# EAGLE schematic badge_mil (EAGLE 7.1.0)
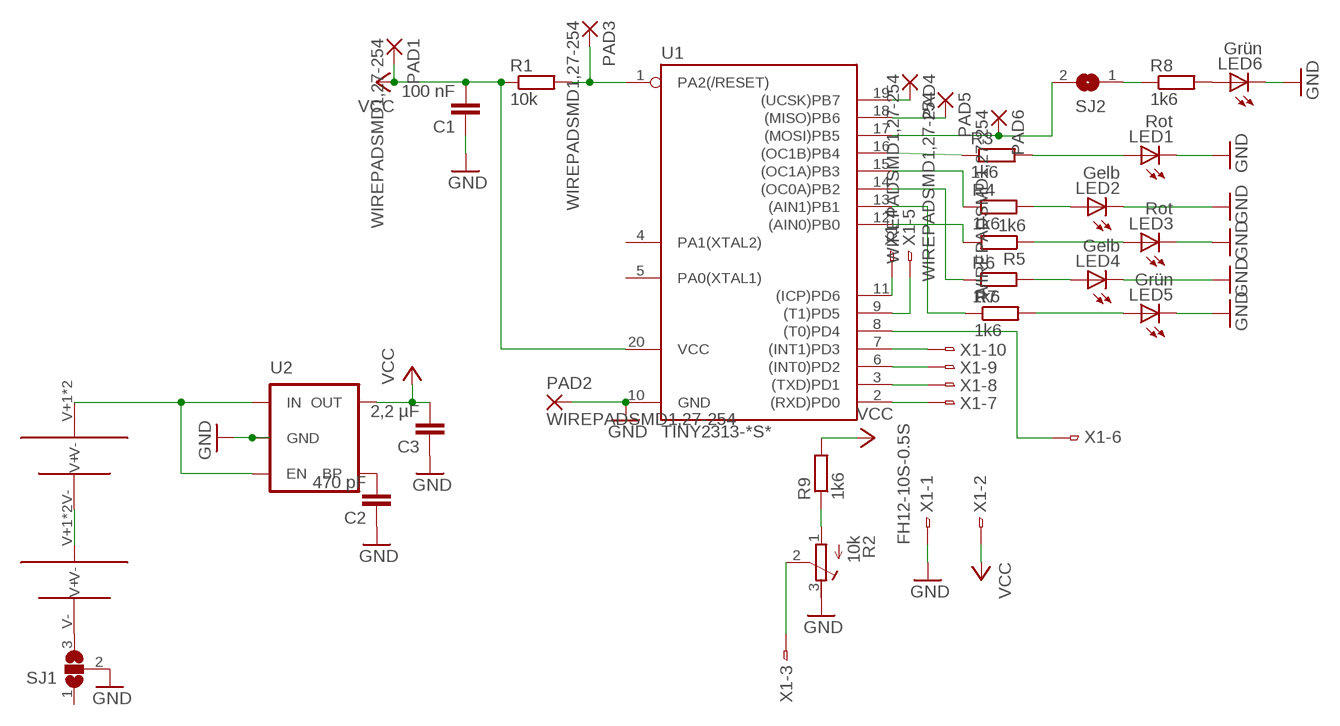
[diagram p0: schematic, sheet 1]

## Parts
C1  100 nF  C-EUC0805  [C0805]
C2  470 pF  C-EUC0805  [C0805]
C3  2,2 µF  C-EUC0805  [C0805]
LED1  Rot  LEDSML0603  [SML0603]
LED2  Gelb  LEDSML0603  [SML0603]
LED3  Rot  LEDSML0603  [SML0603]
LED4  Gelb  LEDSML0603  [SML0603]
LED5  Grün  LEDSML0603  [SML0603]
LED6  Grün  LEDSML0603  [SML0603]
PAD1  WIREPADSMD1,27-254  [SMD1,27-2,54]
PAD2  WIREPADSMD1,27-254  [SMD1,27-2,54]
PAD3  WIREPADSMD1,27-254  [SMD1,27-2,54]
PAD4  WIREPADSMD1,27-254  [SMD1,27-2,54]
PAD5  WIREPADSMD1,27-254  [SMD1,27-2,54]
PAD6  WIREPADSMD1,27-254  [SMD1,27-2,54]
R1  10k  R-EU_R0805  [R0805]
R2  10k  R-TRIMM4G/J  [RTRIM4G/J]
R3  1k6  R-EU_R0805  [R0805]
R4  1k6  R-EU_R0805  [R0805]
R5  1k6  R-EU_R0805  [R0805]
R6  1k6  R-EU_R0805  [R0805]
R7  1k6  R-EU_R0805  [R0805]
R8  1k6  R-EU_R0805  [R0805]
R9  1k6  R-EU_R0805  [R0805]
SJ1  SJ2WW  [SJ_2W]
SJ2  SJW  [SJW]
U1  TINY2313-*S*  [SO20L$]
U2  MIC52055V  [SOT23-5]
U$1  KEYSTONE3002  [KEYSTONE3002]
U$2  KEYSTONE3002  [KEYSTONE3002]
X1  FH12-10S-0.5S  [FH12-10S-1.0SH]

## Nets
GND: C1.1 C2.1 C3.1 LED1.C LED2.C LED3.C LED4.C LED5.C LED6.C PAD2.1(P) R2.3(A) SJ1.2 U1.10(GND) U2.2(GND) X1.1
N$1: PAD3.1(P) R1.2 U1.1(PA2(/RESET))
N$2: PAD5.1(P) U1.18((MISO)PB6)
N$3: PAD6.1(P) SJ2.2 U1.17((MOSI)PB5)
N$4: PAD4.1(P) U1.19((UCSK)PB7)
N$5: LED6.A R8.2
N$6: LED5.A R7.2
N$7: LED4.A R6.2
N$8: U$1.V- U$2.V+1(V+) U$2.V+2(V+)
N$9: LED1.A R3.2
N$10: R3.1 U1.16((OC1B)PB4)
N$11: R4.1 U1.15((OC1A)PB3)
N$12: R6.1 U1.14((OC0A)PB2)
N$13: R7.1 U1.13((AIN1)PB1)
N$14: U1.2((RXD)PD0) X1.7
N$15: U1.3((TXD)PD1) X1.8
N$16: U1.6((INT0)PD2) X1.9
N$17: U1.7((INT1)PD3) X1.10
N$18: U1.8((T0)PD4) X1.6
N$19: U1.9((T1)PD5) X1.5
N$20: U1.11((ICP)PD6) X1.4
N$21: R2.1(E) R9.1
N$23: SJ1.3 U$2.V-
N$24: R8.1 SJ2.1
N$28: C2.2 U2.4(BP)
N$29: U2.1(IN) U2.3(EN) U$1.V+1(V+) U$1.V+2(V+)
N$36: LED2.A R4.2
N$39: LED3.A R5.1
N$40: R5.2 U1.12((AIN0)PB0)
N$42: R2.2(S) X1.3
VCC: C1.2 C3.2 PAD1.1(P) R1.1 R9.2 U1.20(VCC) U2.5(OUT) X1.2
Unconnected: SJ1.1 U1.4(PA1(XTAL2)) U1.5(PA0(XTAL1))

## Library data of the parts
C1-C3 = rcl:C-EU: CAPACITOR, European symbol
LED1-LED6 = led:LED: LED OSRAM: - CHIPLED LG R971, LG N971, LY N971, LG Q971, LY Q971, LO R971, LY R971 LH N974, LH R974 LS Q976, LO Q976, LY Q976 LO Q996 - Hyper CHIPLED LW Q18S LB Q993, LB Q99A, LB R99A - SideLED LS A670, LO A670, LY A670, LG A670, LP A670 LB A673, LV A673, LT A673, LW A673 LH A674 LY A675 LS A676, LA A676, LO A676, LY A676, LW A676 LS A679, LY A679, LG A679 - Hyper Micro SIDELED® LS Y876, LA Y876, LO Y876, LY Y876 LT Y87S - SmartLED LW L88C, LW L88S LB L89C, LB L89S, LG L890 LS L89K, LO L89K, LY L89K LS L896, LA L896, LO L896, LY L896 - TOPLED LS T670, LO T670, LY T670, LG T670, LP T670 LSG T670, LSP T670, LSY T670, LOP T670, LYG T670 LG T671, LOG T671, LSG T671 LB T673, LV T673, LT T673, LW T673 LH T674 LS T676, LA T676, LO T676, LY T676, LB T676, LH T676, LSB T676, LW T676 LB T67C, LV T67C, LT T67C, LS T67K, LO T67K, LY T67K, LW E67C LS E67B, LA E67B, LO E67B, LY E67B, LB E67C, LV E67C, LT E67C LW T67C LS T679, LY T679, LG T679 LS T770, LO T770, LY T770, LG T770, LP T770 LB T773, LV T773, LT T773, LW T773 LH T774 LS E675, LA E675, LY E675, LS T675 LS T776, LA T776, LO T776, LY T776, LB T776 LHGB T686 LT T68C, LB T68C - Hyper Mini TOPLED® LB M676 - Mini TOPLED Santana® LG M470 LS M47K, LO M47K, LY M47K Source: http://www.osram.convergy.de LUXEON: - LUMILED® LXK2-PW12-R00, LXK2-PW12-S00, LXK2-PW14-U00, LXK2-PW14-V00 LXK2-PM12-R00, LXK2-PM12-S00, LXK2-PM14-U00 LXK2-PE12-Q00, LXK2-PE12-R00, LXK2-PE12-S00, LXK2-PE14-T00, LXK2-PE14-U00 LXK2-PB12-K00, LXK2-PB12-L00, LXK2-PB12-M00, LXK2-PB14-N00, LXK2-PB14-P00, LXK2-PB14-Q00 LXK2-PR12-L00, LXK2-PR12-M00, LXK2-PR14-Q00, LXK2-PR14-R00 LXK2-PD12-Q00, LXK2-PD12-R00, LXK2-PD12-S00 LXK2-PH12-R00, LXK2-PH12-S00 LXK2-PL12-P00, LXK2-PL12-Q00, LXK2-PL12-R00 Source: www.luxeon.com KINGBRIGHT: KA-3528ASYC Source: www.kingbright.com
PAD1-PAD6 = wirepad:WIREPAD: Wire PAD connect wire on PCB
R1 R3-R9 = resistor:R-EU_: RESISTOR, European symbol; SPICEPREFIX: R
R2 = resistor:R-TRIMM: Trimm resistor
SJ1 = jumper:SJ2W: SMD solder JUMPER
SJ2 = jumper:SJ: SMD solder JUMPER
U1 = avr-6:TINY2313*: Atmel Tiny2313 2K Flash, 128 bytes EEPROM, 128 bytes RAM
U2 = SparkFun-PowerIC:MIC5205: MIC5205 150mA vreg 3.3V - VREG-00822 5V - VREG-00823; PROD_ID: VREG-00823
U$1 U$2 = draradech:KEYSTONE3002
X1 = con-hirose:FH12-10S-0.5S: 0.5mm Pitch Connectors For FPC/FFC Source: Data sheet <http://www.hirose.co.jp/cataloge_hp/e58605370.pdf>